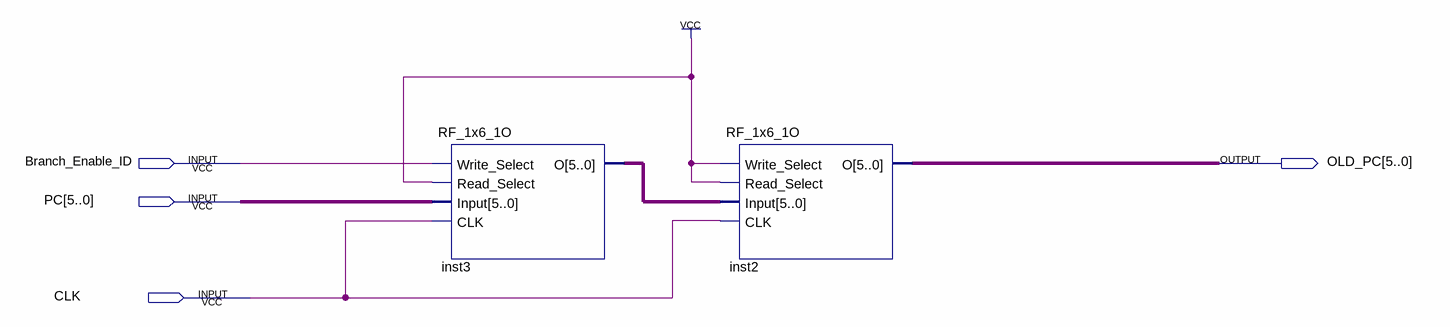
[diagram p0: schematic sheet]
// Quartus schematic PC_Storage.bdf as structural Verilog: 2 symbols, 4 pins
module PC_Storage (
  input  Branch_Enable_ID,
  input  [5:0] PC,
  input  CLK,
  output [5:0] OLD_PC
);

  wire [5:0] inst3_o;

  RF_1x6_1O inst3 (.Write_Select(Branch_Enable_ID), .Read_Select(1'b1), .Input(PC), .CLK(CLK), .O(inst3_o));
  RF_1x6_1O inst2 (.Write_Select(1'b1), .Read_Select(1'b1), .Input(inst3_o), .CLK(CLK), .O(OLD_PC));
endmodule
